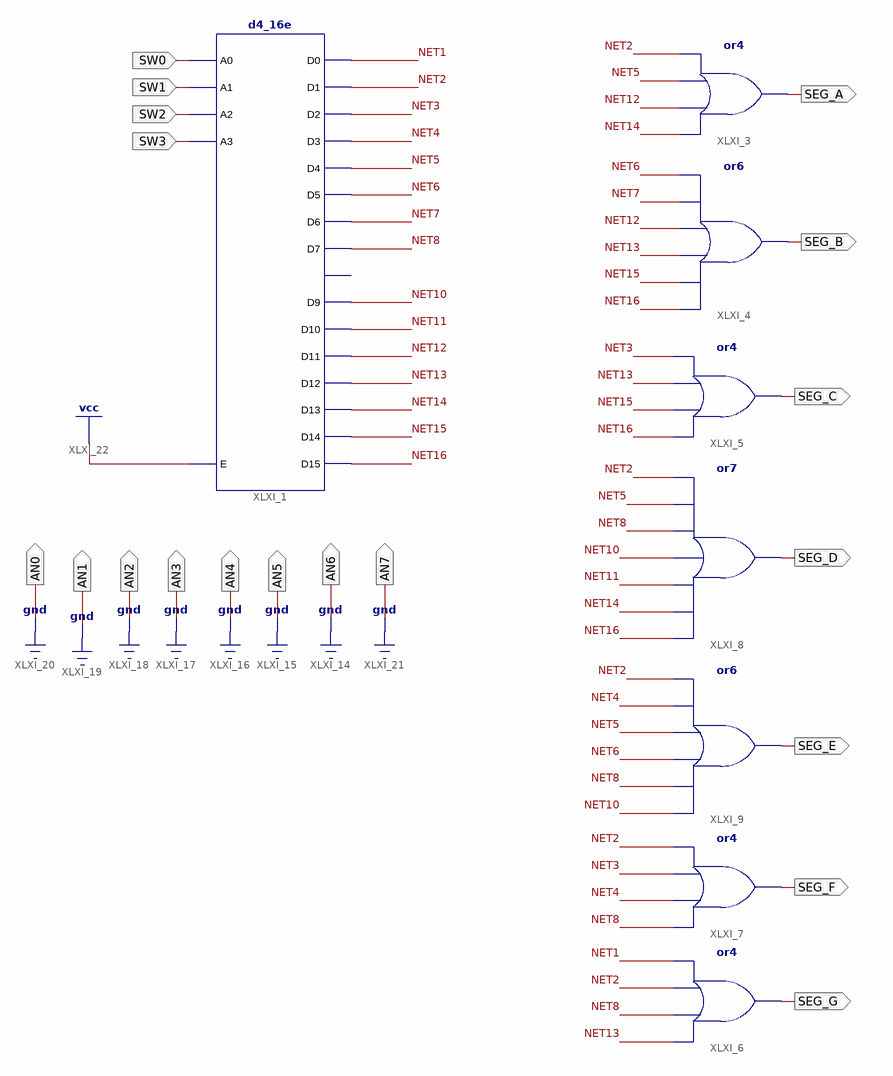
[diagram p0: schematic sheet 1]
// Xilinx ISE schematic dec_7_seg.sch (artix7) as structural Verilog: 8 symbols, 19 ports
module dec_7_seg (
  input  SW0,
  input  SW1,
  input  SW2,
  input  SW3,
  output SEG_A,
  output SEG_B,
  output SEG_C,
  output SEG_D,
  output SEG_E,
  output SEG_F,
  output SEG_G,
  output AN0,
  output AN1,
  output AN2,
  output AN3,
  output AN4,
  output AN5,
  output AN6,
  output AN7
);

  wire NET1, NET2, NET3, NET4, NET5, NET6, NET7, NET8, NET10, NET11, NET12, NET13, NET14, NET15, NET16;

  d4_16e XLXI_1 (
    .A0(SW0), .A1(SW1), .A2(SW2), .A3(SW3), .E(1'b1), .D0(NET1), .D1(NET2), .D10(NET11), .D11(NET12),
    .D12(NET13), .D13(NET14), .D14(NET15), .D15(NET16), .D2(NET3), .D3(NET4), .D4(NET5), .D5(NET6),
    .D6(NET7), .D7(NET8), .D9(NET10));  // open: D8
  or XLXI_3 (SEG_A, NET14, NET12, NET5, NET2);
  or XLXI_4 (SEG_B, NET16, NET15, NET13, NET12, NET7, NET6);
  or XLXI_5 (SEG_C, NET16, NET15, NET13, NET3);
  or XLXI_6 (SEG_G, NET13, NET8, NET2, NET1);
  or XLXI_7 (SEG_F, NET8, NET4, NET3, NET2);
  or XLXI_8 (SEG_D, NET16, NET14, NET11, NET10, NET8, NET5, NET2);
  or XLXI_9 (SEG_E, NET10, NET8, NET6, NET5, NET4, NET2);

  assign AN0 = 1'b0;
  assign AN1 = 1'b0;
  assign AN2 = 1'b0;
  assign AN3 = 1'b0;
  assign AN4 = 1'b0;
  assign AN5 = 1'b0;
  assign AN6 = 1'b0;
  assign AN7 = 1'b0;
endmodule
